# EAGLE design VIC-MIDI_v0.2 (EAGLE 5.11)
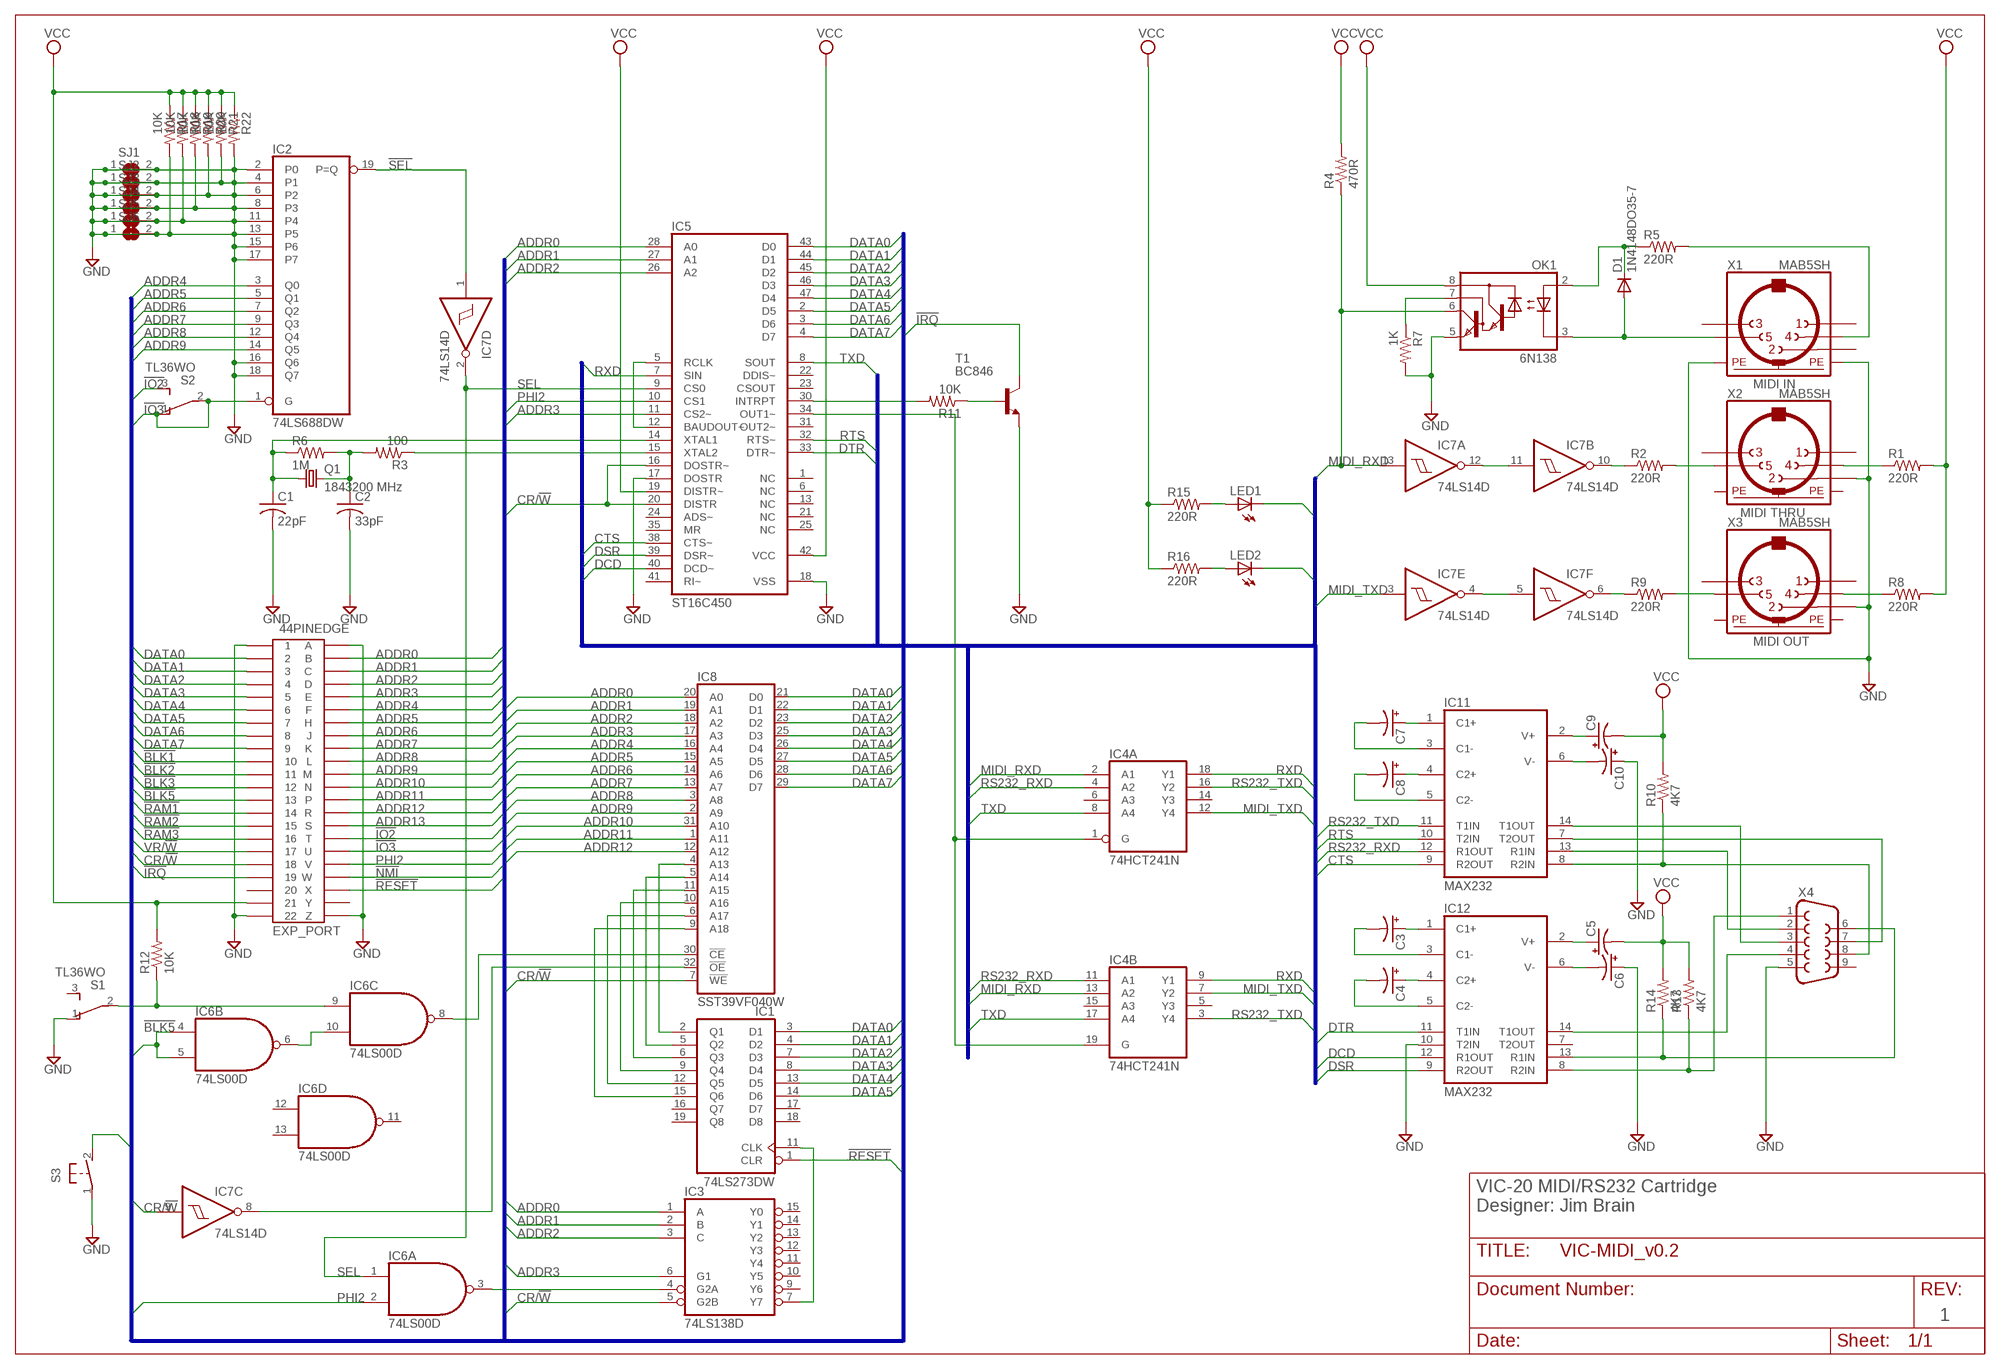
[diagram p0: schematic, sheet 1]

## Parts
44PINEDGE  EXP_PORT  MA-44  [MA-44]
C1  22pF  C-USC0805  [C0805]
C2  33pF  C-USC0805  [C0805]
C3  CPOL-USB  [PANASONIC_B]
C4  CPOL-USB  [PANASONIC_B]
C5  CPOL-USB  [PANASONIC_B]
C6  CPOL-USB  [PANASONIC_B]
C7  CPOL-USB  [PANASONIC_B]
C8  CPOL-USB  [PANASONIC_B]
C9  CPOL-USB  [PANASONIC_B]
C10  CPOL-USB  [PANASONIC_B]
D1  1N4148DO35-7  [DO35-7]
IC1  74LS273DW  [SO20W]
IC2  74LS688DW  [SO20W]
IC3  74LS138D  [SO16]
IC4  74HCT241N  74LS241DW  [SO20W]
IC5  ST16C450  XR-16C450Q  [TQFP48]
IC6  74LS00D  [SO14]
IC7  74LS14D  [SO14]
IC8  SST39VF040W  [TSOP32]
IC11  MAX232  [DIL16]
IC12  MAX232  [DIL16]
LED1  LED3MM  [LED3MM]
LED2  LED3MM  [LED3MM]
OK1  6N138  [DIL08]
Q1  1843200 MHz  CRYSTALHC49UP  [HC49UP]
R1  220R  R-US_R0805  [R0805]
R2  220R  R-US_R0805  [R0805]
R3  100  R-US_R0805  [R0805]
R4  470R  R-US_R0805  [R0805]
R5  220R  R-US_R0805  [R0805]
R6  1M  R-US_R0805  [R0805]
R7  1K  R-US_R0805  [R0805]
R8  220R  R-US_R0805  [R0805]
R9  220R  R-US_R0805  [R0805]
R10  4K7  R-US_M0805  [M0805]
R11  10K  R-US_R0805  [R0805]
R12  10K  R-US_R0805  [R0805]
R13  4K7  R-US_R0805  [R0805]
R14  4K7  R-US_R0805  [R0805]
R15  220R  R-US_R0805  [R0805]
R16  220R  R-US_R0805  [R0805]
R17  10K  R-US_M0805  [M0805]
R18  10K  R-US_M0805  [M0805]
R19  10K  R-US_M0805  [M0805]
R20  10K  R-US_M0805  [M0805]
R21  10K  R-US_M0805  [M0805]
R22  10K  R-US_M0805  [M0805]
S1  TL36WO  [TL3XWO]
S2  TL36WO  [TL3XWO]
S3  31-XX  [B3F-31XX]
SJ1  SJ  [SJ]
SJ2  SJ  [SJ]
SJ3  SJ  [SJ]
SJ4  SJ  [SJ]
SJ5  SJ  [SJ]
SJ6  SJ  [SJ]
T1  BC846  [SOT23]
X1  MAB5SH  [MAB5SH]
X2  MAB5SH  [MAB5SH]
X3  MAB5SH  [MAB5SH]
X4  F09HP  [F09HP]

## Nets
!BLK1: 44PINEDGE.10
!BLK2: 44PINEDGE.11
!BLK3: 44PINEDGE.12
!BLK5: 44PINEDGE.13 IC6.4(B:I0) IC6.5(B:I1)
!IO2: 44PINEDGE.T S2.3(S)
!IO3: 44PINEDGE.U IC2.1(G) S2.1(O) S2.2(P)
!IRQ: 44PINEDGE.19 T1.3(C)
!NMI: 44PINEDGE.W
!RAM1: 44PINEDGE.14
!RAM2: 44PINEDGE.15
!RAM3: 44PINEDGE.16
!RESET: 44PINEDGE.X IC1.1(CLR) S3.2(S)
!SEL: IC2.19(P=Q) IC7.1(D:I)
ADDR0: 44PINEDGE.B IC3.1(A) IC5.28(A0) IC8.20(A0)
ADDR1: 44PINEDGE.C IC3.2(B) IC5.27(A1) IC8.19(A1)
ADDR2: 44PINEDGE.D IC3.3(C) IC5.26(A2) IC8.18(A2)
ADDR3: 44PINEDGE.E IC3.6(G1) IC5.11(CS2~) IC8.17(A3)
ADDR4: 44PINEDGE.F IC2.3(Q0) IC8.16(A4)
ADDR5: 44PINEDGE.H IC2.5(Q1) IC8.15(A5)
ADDR6: 44PINEDGE.J IC2.7(Q2) IC8.14(A6)
ADDR7: 44PINEDGE.K IC2.9(Q3) IC8.13(A7)
ADDR8: 44PINEDGE.L IC2.12(Q4) IC8.3(A8)
ADDR9: 44PINEDGE.M IC2.14(Q5) IC8.2(A9)
ADDR10: 44PINEDGE.N IC8.31(A10)
ADDR11: 44PINEDGE.P IC8.1(A11)
ADDR12: 44PINEDGE.R IC8.12(A12)
ADDR13: 44PINEDGE.S
CR/!W: 44PINEDGE.18 IC3.5(G2B) IC5.16(DOSTR~) IC5.20(DISTR) IC7.9(C:I) IC8.7(!WE)
CTS: IC5.38(CTS~) IC11.9(R2OUT)
DATA0: 44PINEDGE.2 IC1.3(D1) IC5.43(D0) IC8.21(D0)
DATA1: 44PINEDGE.3 IC1.4(D2) IC5.44(D1) IC8.22(D1)
DATA2: 44PINEDGE.4 IC1.7(D3) IC5.45(D2) IC8.23(D2)
DATA3: 44PINEDGE.5 IC1.8(D4) IC5.46(D3) IC8.25(D3)
DATA4: 44PINEDGE.6 IC1.13(D5) IC5.47(D4) IC8.26(D4)
DATA5: 44PINEDGE.7 IC1.14(D6) IC5.2(D5) IC8.27(D5)
DATA6: 44PINEDGE.8 IC5.3(D6) IC8.28(D6)
DATA7: 44PINEDGE.9 IC5.4(D7) IC8.29(D7)
DCD: IC5.40(DCD~) IC12.12(R1OUT)
DSR: IC5.39(DSR~) IC12.9(R2OUT)
DTR: IC5.33(DTR~) IC12.11(T1IN)
GND: 44PINEDGE.1 44PINEDGE.22 44PINEDGE.A 44PINEDGE.Z C1.2 C2.2 C6.+ C10.+ IC2.2(P0) IC2.4(P1) IC2.6(P2) IC2.8(P3) IC2.11(P4) IC2.13(P5) IC2.15(P6) IC2.16(Q6) IC2.17(P7) IC2.18(Q7) IC5.17(DOSTR) IC5.18(VSS) IC12.10(T2IN) OK1.5(GND) R7.2 R17.2 R18.2 R19.2 R20.2 R21.2 R22.2 S1.1(O) S3.1(P) SJ1.1 SJ1.2 SJ2.1 SJ2.2 SJ3.1 SJ3.2 SJ4.1 SJ4.2 SJ5.1 SJ5.2 SJ6.1 SJ6.2 T1.2(E) X1.PE X1.PE@(PE) X2.2 X3.2 X4.5
MIDI_RXD: IC4.2(A:A1) IC4.13(B:A2) IC7.13(A:I) OK1.6(VO) R4.1
MIDI_TXD: IC4.7(B:Y2) IC4.12(A:Y4) IC7.3(E:I)
N$1: R9.2 X3.5
N$2: IC7.6(F:O) R9.1
N$3: R8.1 X3.4
N$4: IC7.4(E:O) IC7.5(F:I)
N$5: LED1.A R15.2
N$6: D1.C OK1.2(A) R5.1
N$7: R5.2 X1.4
N$8: D1.A OK1.3(C) X1.5
N$9: OK1.7(VB) R7.1
N$10: R2.2 X2.5
N$11: IC7.10(B:O) R2.1
N$12: IC7.11(B:I) IC7.12(A:O)
N$13: R1.1 X2.4
N$14: IC1.11(CLK) IC3.7(Y7)
N$15: IC5.15(XTAL2) R3.1
N$16: C1.1 IC5.14(XTAL1) Q1.1 R6.1
N$17: C2.1 Q1.2 R3.2 R6.2
N$18: IC1.5(Q2) IC8.5(A14)
N$19: IC5.5(RCLK) IC5.12(BAUDOUT~)
N$20: IC1.2(Q1) IC8.4(A13)
N$21: IC1.6(Q3) IC8.11(A15)
N$22: IC1.9(Q4) IC8.10(A16)
N$23: IC6.6(B:O) IC6.10(C:I1)
N$24: IC7.8(C:O) IC8.32(!OE)
N$25: LED2.A R16.2
N$26: IC6.8(C:O) IC8.30(!CE)
N$27: IC6.9(C:I0) R12.1 S1.2(P)
N$28: IC1.12(Q5) IC8.6(A17)
N$29: IC3.4(G2A) IC6.3(A:O)
N$30: IC1.15(Q6) IC8.9(A18)
N$31: IC5.30(INTRPT) R11.2
N$32: R11.1 T1.1(B)
N$35: IC4.1(A:G) IC4.19(B:G) IC5.34(OUT1~)
N$36: C3.+ IC12.1(C1+)
N$37: C3.- IC12.3(C1-)
N$38: C4.+ IC12.4(C2+)
N$39: C4.- IC12.5(C2-)
N$40: C5.+ IC12.2(V+)
N$41: C6.- IC12.6(V-)
N$42: C7.+ IC11.1(C1+)
N$43: C7.- IC11.3(C1-)
N$44: C8.+ IC11.4(C2+)
N$45: C8.- IC11.5(C2-)
N$46: C9.+ IC11.2(V+)
N$47: C10.- IC11.6(V-)
N$50: IC12.14(T1OUT) X4.4
N$51: IC11.14(T1OUT) X4.3
N$52: IC11.7(T2OUT) X4.7
N$53: IC11.8(R2IN) R10.1 X4.8
N$55: IC12.13(R1IN) R14.1 X4.6
N$56: IC12.8(R2IN) R13.1 X4.1
N$58: IC11.13(R1IN) X4.2
PHI2: 44PINEDGE.V IC5.10(CS1) IC6.2(A:I1)
RS232_RXD: IC4.4(A:A2) IC4.11(B:A1) IC11.12(R1OUT)
RS232_TXD: IC4.3(B:Y4) IC4.16(A:Y2) IC11.11(T1IN)
RTS: IC5.32(RTS~) IC11.10(T2IN)
RXD: IC4.9(B:Y1) IC4.18(A:Y1) IC5.7(SIN) LED2.K(C)
SEL: IC5.9(CS0) IC6.1(A:I0) IC7.2(D:O)
TXD: IC4.8(A:A4) IC4.17(B:A4) IC5.8(SOUT) LED1.K(C)
VCC: 44PINEDGE.21 C5.- C9.- IC5.19(DISTR~) IC5.42(VCC) OK1.8(VCC) R1.2 R4.2 R8.2 R10.2 R12.2 R13.2 R14.2 R15.1 R16.1 R17.1 R18.1 R19.1 R20.1 R21.1 R22.1
VR/!W: 44PINEDGE.17
Unconnected: 44PINEDGE.20 44PINEDGE.Y IC1.16(Q7) IC1.17(D7) IC1.18(D8) IC1.19(Q8) IC3.9(Y6) IC3.10(Y5) IC3.11(Y4) IC3.12(Y3) IC3.13(Y2) IC3.14(Y1) IC3.15(Y0) IC4.5(B:Y3) IC4.6(A:A3) IC4.14(A:Y3) IC4.15(B:A3) IC5.1(NC) IC5.6(NC) IC5.13(NC) IC5.21(NC) IC5.22(DDIS~) IC5.23(CSOUT) IC5.24(ADS~) IC5.25(NC) IC5.31(OUT2~) IC5.35(MR) IC5.41(RI~) IC6.11(D:O) IC6.12(D:I0) IC6.13(D:I1) IC12.7(T2OUT) S1.3(S) X1.1 X1.2 X1.3 X2.1 X2.3 X3.1 X3.3 X4.9

## Buses
DATA[0..7],ADDR[0..13],VR/!W,CR/!W,!BLK1,!BLK2,!BLK3,!BLK5,!RAM1,!RAM2,!RAM3,!IRQ,!NMI,!IO2,!IO3,PHI2,!RESET
RXD,TXD,DCD,RTS,CTS,DSR,DTR,MIDI_RXD,MIDI_TXD,RS232_RXD,RS232_TXD

## Notes on the sheet
- MIDI IN
- MIDI THRU
- MIDI OUT
- VIC-20 MIDI/RS232 Cartridge
- Designer: Jim Brain
- 1

## Power pins joined to a net without a drawn wire
GND: IC1.10(GND) IC2.10(GND) IC3.8(GND) IC4.10(P:GND) IC6.7(P:GND) IC7.7(P:GND) IC8.24(GND) IC11.15(GND) IC12.15(GND)
PE: X2.PE X2.PE@(PE) X3.PE X3.PE@(PE)
VCC: IC1.20(VCC) IC2.20(VCC) IC3.16(VCC) IC4.20(P:VCC) IC6.14(P:VCC) IC7.14(P:VCC) IC8.8(VCC) IC11.16(VCC) IC12.16(VCC)

## Library data of the parts
44PINEDGE = con-edge-156:MA-44: 44 PIN EDGE CONNECTOR FOR PCB
C1 C2 = rcl:C-US: CAPACITOR, American symbol
C3-C10 = rcl:CPOL-US: POLARIZED CAPACITOR, American symbol
D1 = diode:1N4148: DIODE high speed (Philips)
IC1 = 74xx-us:74*273: Octal D type FLIP FLOP, clear
IC2 = 74xx-us:74*688: 8-bit MAGNITUDE/IDENTITY COMPARATOR, totem pole
IC3 = 74xx-us:74*138: 3-line to 8-line DECODER/DEMULTIPLEXER
IC4 = 74xx-us:74*241: Octal BUFFER and LINE DRIVER, 3-state
IC5 = exar:XR-16C450Q: UART
IC6 = 74xx-us:74*00: Quad 2-input NAND gate
IC7 = 74xx-us:74*14: Hex schmitt trigger INVERTER
IC8 = memory:SST39VF040: 4 Mbit x8 Multi-Purpose Flash Source: http://www.sst.com/dotAsset/40782.pdf
IC11 IC12 = maxim:MAX232: RS232 TRANSEIVER
LED1 LED2 = led:LED: LED OSRAM: - CHIPLED LG R971, LG N971, LY N971, LG Q971, LY Q971, LO R971, LY R971 LH N974, LH R974 LS Q976, LO Q976, LY Q976 LO Q996 - Hyper CHIPLED LW Q18S LB Q993, LB Q99A, LB R99A - SideLED LS A670, LO A670, LY A670, LG A670, LP A670 LB A673, LV A673, LT A673, LW A673 LH A674 LY A675 LS A676, LA A676, LO A676, LY A676, LW A676 LS A679, LY A679, LG A679 - Hyper Micro SIDELED® LS Y876, LA Y876, LO Y876, LY Y876 LT Y87S - SmartLED LW L88C, LW L88S LB L89C, LB L89S, LG L890 LS L89K, LO L89K, LY L89K LS L896, LA L896, LO L896, LY L896 - TOPLED LS T670, LO T670, LY T670, LG T670, LP T670 LSG T670, LSP T670, LSY T670, LOP T670, LYG T670 LG T671, LOG T671, LSG T671 LB T673, LV T673, LT T673, LW T673 LH T674 LS T676, LA T676, LO T676, LY T676, LB T676, LH T676, LSB T676, LW T676 LB T67C, LV T67C, LT T67C, LS T67K, LO T67K, LY T67K, LW E67C LS E67B, LA E67B, LO E67B, LY E67B, LB E67C, LV E67C, LT E67C LW T67C LS T679, LY T679, LG T679 LS T770, LO T770, LY T770, LG T770, LP T770 LB T773, LV T773, LT T773, LW T773 LH T774 LS E675, LA E675, LY E675, LS T675 LS T776, LA T776, LO T776, LY T776, LB T776 LHGB T686 LT T68C, LB T68C - Hyper Mini TOPLED® LB M676 - Mini TOPLED Santana® LG M470 LS M47K, LO M47K, LY M47K Source: http://www.osram.convergy.de LUXEON: - LUMILED® LXK2-PW12-R00, LXK2-PW12-S00, LXK2-PW14-U00, LXK2-PW14-V00 LXK2-PM12-R00, LXK2-PM12-S00, LXK2-PM14-U00 LXK2-PE12-Q00, LXK2-PE12-R00, LXK2-PE12-S00, LXK2-PE14-T00, LXK2-PE14-U00 LXK2-PB12-K00, LXK2-PB12-L00, LXK2-PB12-M00, LXK2-PB14-N00, LXK2-PB14-P00, LXK2-PB14-Q00 LXK2-PR12-L00, LXK2-PR12-M00, LXK2-PR14-Q00, LXK2-PR14-R00 LXK2-PD12-Q00, LXK2-PD12-R00, LXK2-PD12-S00 LXK2-PH12-R00, LXK2-PH12-S00 LXK2-PL12-P00, LXK2-PL12-Q00, LXK2-PL12-R00 Source: www.luxeon.com KINGBRIGHT: KA-3528ASYC Source: www.kingbright.com
OK1 = optocoupler:6N138: MOTOROLA OPTO COUPLER; MF: VISHAY/TELEFUNKEN; MPN: 6N138; OC_FARNELL: 9860150; OC_NEWARK: 35K5294
Q1 = crystal:CRYSTAL: CRYSTAL
R1-R9 R11 R12 R15-R22 = resistor:R-US_: RESISTOR, American symbol
R10 R13 R14 = rcl:R-US_: RESISTOR, American symbol
S1 S2 = switch:TL36WO: TINY SWITCH ON - ON Source: http://www2.produktinfo.conrad.com/datenblaetter/700000-724999/705152-da-01-de-Subminiaturschalter_TL_36WO.pdf
S3 = switch-omron:31-XX: OMRON SWITCH; MPN: B3F-3100; OC_FARNELL: 959704; OC_NEWARK: 36M3582
SJ1-SJ6 = jumper:SJ: SMD solder JUMPER
T1 = transistor:BC846: NPN TRANSISTOR
X1-X3 = con-hirschmann:MAB5SH: Female CONNECTOR 5 pins 90 deg. with shield, horizontal (DIN 41524)
X4 = con-subd:F09: SUB-D; OC_FARNELL: unknown; OC_NEWARK: unknown

## Board
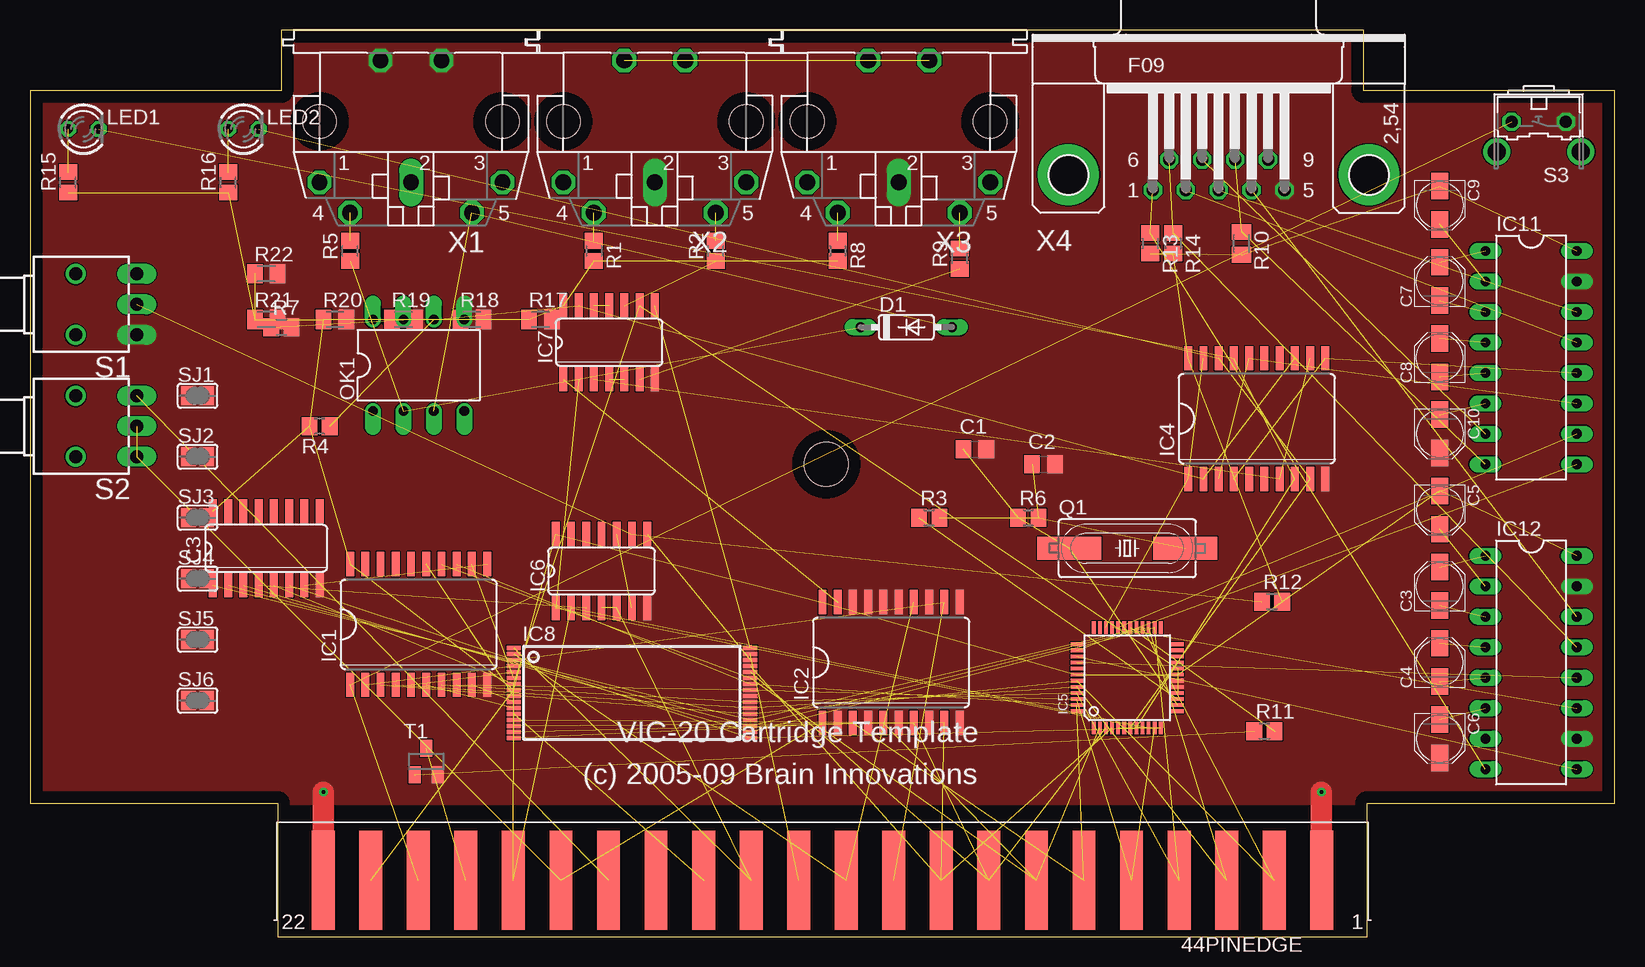
[diagram p1: board, top side]
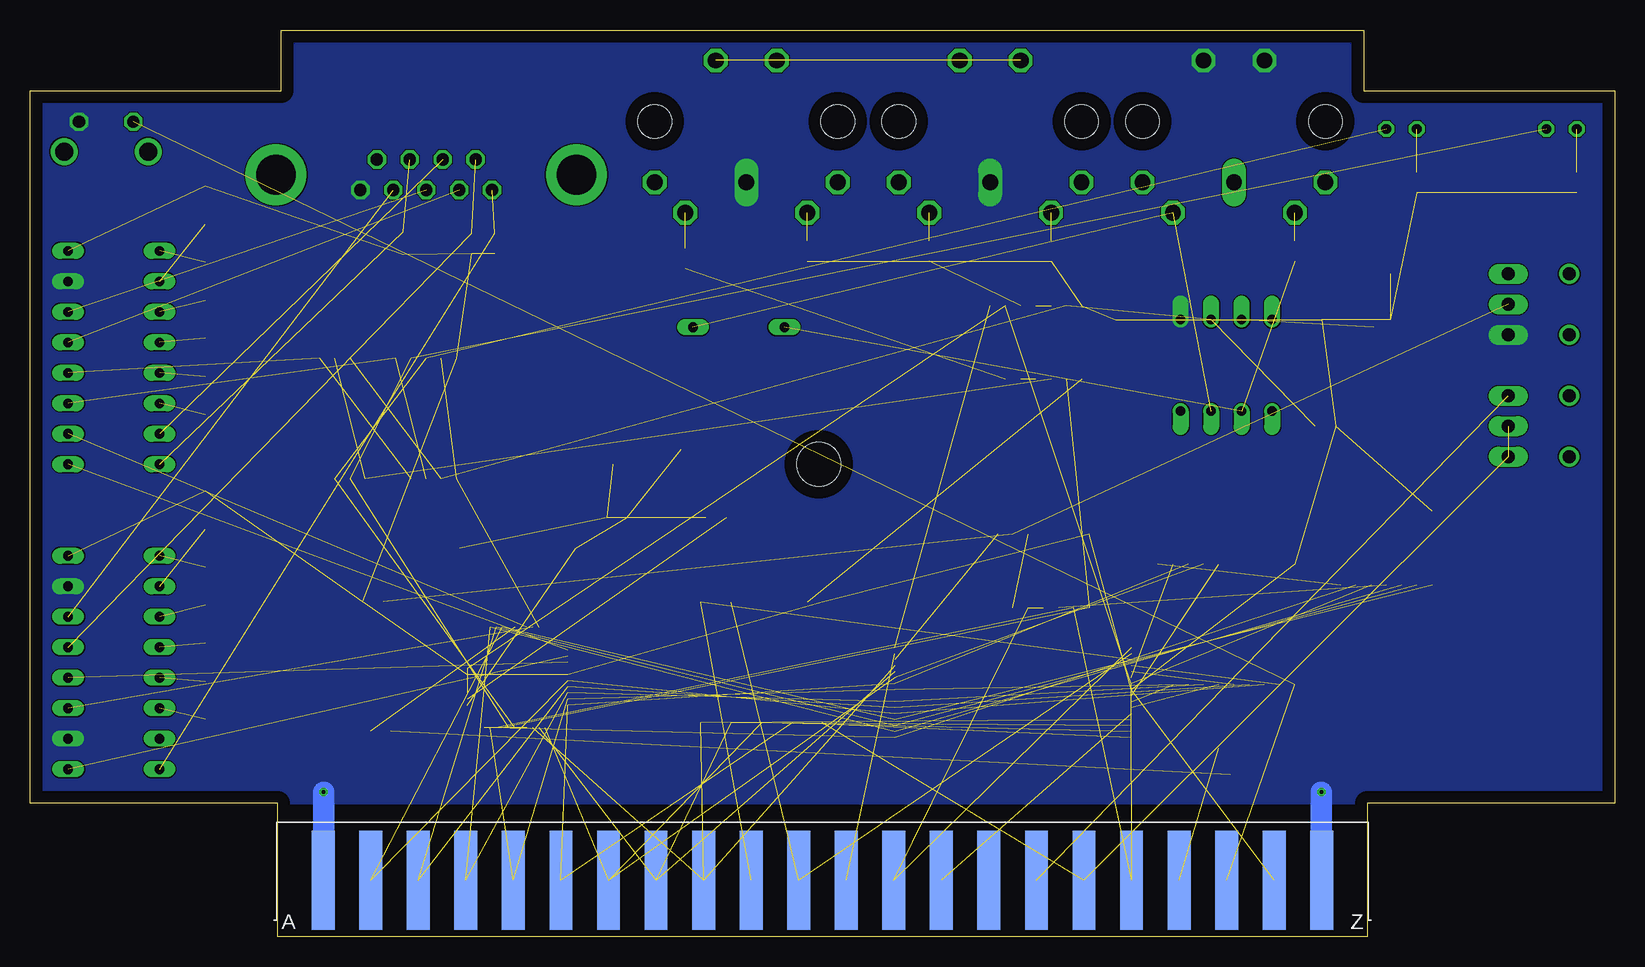
[diagram p2: board, bottom side, seen from below]

Size 132.08 x 75.56 mm. Coordinates in mm from the lower left corner, seen from the top.
Outline: 20.64,0 111.44,0 111.44,11.11 132.08,11.11 132.08,70.48 111.12,70.48 111.12,75.56 20.95,75.56 20.95,70.48 0,70.48 0,11.11 20.64,11.11 20.64,0
Copper layers (1*16): Top 0.035mm / dielectric 1.5mm / Bottom 0.035mm
Design rules "ourpcb-small": minimum track width 4mil, minimum drill 12mil, track to track 4mil, track to pad 4mil, pad to pad 4mil, via to via 4mil, smd to smd 0mil, copper to edge 40mil, drill to drill 8mil, minimum pad ring 10mil, minimum via ring 8mil, stop-mask expansion 4mil, vias tented up to drill 0mil, thermal gap 10mil
Holes 3.64 mm at 66.36,39.37

### Footprints (pad centres in the part's own frame; a part is rotated, then mirrored left to right if it is on the bottom)
MA-44 = smd 1.905 x 8.255: 1 -41.605,4.826; 2 -37.643,4.826; 3 -33.68,4.826; 4 -29.718,4.826; 5 -25.756,4.826; 6 -21.793,4.826; 7 -17.831,4.826; 8 -13.868,4.826; 9 -9.906,4.826; 10 -5.944,4.826; 11 -1.981,4.826; 12 1.981,4.826; 13 5.944,4.826; 14 9.906,4.826; 15 13.868,4.826; 16 17.831,4.826; 17 21.793,4.826; 18 25.756,4.826; 19 29.718,4.826; 20 33.68,4.826; 21 37.643,4.826; 22 41.605,4.826 | smd 1.905 x 8.255 bottom: A -41.605,4.826; B -37.643,4.826; C -33.68,4.826; D -29.718,4.826; E -25.756,4.826; F -21.793,4.826; H -17.831,4.826; J -13.868,4.826; K -9.906,4.826; L -5.944,4.826; M -1.981,4.826; N 1.981,4.826; P 5.944,4.826; R 9.906,4.826; S 13.868,4.826; T 17.831,4.826; U 21.793,4.826; V 25.756,4.826; W 29.718,4.826; X 33.68,4.826; Y 37.643,4.826; Z 41.605,4.826
C0805 = smd 1.3 x 1.5: 1 -0.95,0; 2 0.95,0
PANASONIC_B = smd 2.2 x 1.4: + 1.6,0; - -1.6,0
DO35-7 = drill 0.813 long: A 3.81,0; C -3.81,0
SO20W = smd 0.66 x 2.032: 1 -5.715,-5.029; 2 -4.445,-5.029; 3 -3.175,-5.029; 4 -1.905,-5.029; 5 -0.635,-5.029; 6 0.635,-5.029; 7 1.905,-5.029; 8 3.175,-5.029; 9 4.445,-5.029; 10 5.715,-5.029; 11 5.715,5.029; 12 4.445,5.029; 13 3.175,5.029; 14 1.905,5.029; 15 0.635,5.029; 16 -0.635,5.029; 17 -1.905,5.029; 18 -3.175,5.029; 19 -4.445,5.029; 20 -5.715,5.029
SO16 = smd 0.66 x 2.032: 1 -4.445,-3.073; 2 -3.175,-3.073; 3 -1.905,-3.073; 4 -0.635,-3.073; 5 0.635,-3.073; 6 1.905,-3.073; 7 3.175,-3.073; 8 4.445,-3.073; 9 4.445,3.073; 10 3.175,3.073; 11 1.905,3.073; 12 0.635,3.073; 13 -0.635,3.073; 14 -1.905,3.073; 15 -3.175,3.073; 16 -4.445,3.073
TQFP48 = smd 1.016 x 0.305: 1 -4.191,2.794; 2 -4.191,2.286; 3 -4.191,1.778; 4 -4.191,1.27; 5 -4.191,0.762; 6 -4.191,0.254; 7 -4.191,-0.254; 8 -4.191,-0.762; 9 -4.191,-1.27; 10 -4.191,-1.778; 11 -4.191,-2.286; 12 -4.191,-2.794; 25 4.191,-2.794; 26 4.191,-2.286; 27 4.191,-1.778; 28 4.191,-1.27; 29 4.191,-0.762; 30 4.191,-0.254; 31 4.191,0.254; 32 4.191,0.762; 33 4.191,1.27; 34 4.191,1.778; 35 4.191,2.286; 36 4.191,2.794 | smd 0.305 x 1.016: 13 -2.794,-4.191; 14 -2.286,-4.191; 15 -1.778,-4.191; 16 -1.27,-4.191; 17 -0.762,-4.191; 18 -0.254,-4.191; 19 0.254,-4.191; 20 0.762,-4.191; 21 1.27,-4.191; 22 1.778,-4.191; 23 2.286,-4.191; 24 2.794,-4.191; 37 2.794,4.191; 38 2.286,4.191; 39 1.778,4.191; 40 1.27,4.191; 41 0.762,4.191; 42 0.254,4.191; 43 -0.254,4.191; 44 -0.762,4.191; 45 -1.27,4.191; 46 -1.778,4.191; 47 -2.286,4.191; 48 -2.794,4.191
SO14 = smd 0.66 x 2.032: 1 -3.81,-3.073; 2 -2.54,-3.073; 3 -1.27,-3.073; 4 0,-3.073; 5 1.27,-3.073; 6 2.54,-3.073; 7 3.81,-3.073; 8 3.81,3.073; 9 2.54,3.073; 10 1.27,3.073; 11 0,3.073; 12 -1.27,3.073; 13 -2.54,3.073; 14 -3.81,3.073
TSOP32 = smd 1.2 x 0.36: 1 -9.85,3.75; 2 -9.85,3.25; 3 -9.85,2.75; 4 -9.85,2.25; 5 -9.85,1.75; 6 -9.85,1.25; 7 -9.85,0.75; 8 -9.85,0.25; 9 -9.85,-0.25; 10 -9.85,-0.75; 11 -9.85,-1.25; 12 -9.85,-1.75; 13 -9.85,-2.25; 14 -9.85,-2.75; 15 -9.85,-3.25; 16 -9.85,-3.75; 17 9.85,-3.75; 18 9.85,-3.25; 19 9.85,-2.75; 20 9.85,-2.25; 21 9.85,-1.75; 22 9.85,-1.25; 23 9.85,-0.75; 24 9.85,-0.25; 25 9.85,0.25; 26 9.85,0.75; 27 9.85,1.25; 28 9.85,1.75; 29 9.85,2.25; 30 9.85,2.75; 31 9.85,3.25; 32 9.85,3.75
DIL16 = drill 0.813 long: 1 -8.89,-3.81; 2 -6.35,-3.81; 3 -3.81,-3.81; 4 -1.27,-3.81; 5 1.27,-3.81; 6 3.81,-3.81; 7 6.35,-3.81; 8 8.89,-3.81; 9 8.89,3.81; 10 6.35,3.81; 11 3.81,3.81; 12 1.27,3.81; 13 -1.27,3.81; 14 -3.81,3.81; 15 -6.35,3.81; 16 -8.89,3.81
LED3MM = drill 0.813 octagon: A -1.27,0; K 1.27,0
DIL08 = drill 0.813 offset: 1 -3.81,-3.81; 2 -1.27,-3.81; 3 1.27,-3.81; 4 3.81,-3.81; 5 3.81,3.81; 6 1.27,3.81; 7 -1.27,3.81; 8 -3.81,3.81
HC49UP = smd 5.334 x 1.93: 1 -4.826,0; 2 4.826,0
R0805 = smd 1.3 x 1.5: 1 -0.85,0; 2 0.85,0
M0805 = smd 1.3 x 1.6: 1 -0.95,0; 2 0.95,0
TL3XWO = drill 1.1 pad 1.422 long: 1 -2.54,-5.08; 2 0,-5.08; 3 2.54,-5.08 | drill 1.1 pad 1.676 round: M1 -2.54,0; M2 2.54,0
B3F-31XX = drill 1.016 octagon: 1 -2.261,-1.245; 2 2.261,-1.245 | drill 1.499 pad 2.159 round: 3 -3.505,1.245; 4 3.505,1.245
SJ = smd 1.168 x 1.6: 1 -0.762,0; 2 0.762,0
SOT23 = smd 1 x 1.4: 1 -0.95,-1.1; 2 0.95,-1.1; 3 0,1.1
MAB5SH = drill 1.321 octagon: 1 7.62,5.08; 3 -7.62,5.08; 4 5.08,7.62; 5 -5.08,7.62; PE -2.54,-5.08; PE@ 2.54,-5.08 | drill 1.321 long: 2 0,5.08 | hole 2.794: 7.62,0; -7.62,0
F09HP = drill 1.016 octagon: 1 -5.486,-1.27; 2 -2.743,-1.27; 3 0,-1.27; 4 2.743,-1.27; 5 5.486,-1.27; 6 -4.115,1.27; 7 -1.372,1.27; 8 1.372,1.27; 9 4.115,1.27 | drill 3.302 pad 5.08 round: G1 -12.522,0; G2 12.522,0

### Placement (x,y rotation side)
44PINEDGE  66.04,9.53 180 top
C1  78.74,40.64 0 top
C2  84.45,39.37 0 top
C3  117.47,29.21 90 top
C4  117.47,22.86 90 top
C5  117.47,35.56 270 top
C6  117.47,16.51 270 top
C7  117.47,54.61 90 top
C8  117.47,48.26 90 top
C9  117.47,60.96 270 top
C10  117.47,41.91 270 top
D1  73.02,50.8 0 top
IC1  32.38,26.04 0 top
IC2  71.75,22.86 0 top
IC3  19.69,32.38 0 top
IC4  102.23,43.18 0 top
IC5  91.44,21.59 90 top
IC6  47.62,30.48 0 top
IC7  48.26,49.53 0 top
IC8  50.16,20.32 0 top
IC11  125.09,48.26 270 top
IC12  125.09,22.86 270 top
LED1  4.44,67.31 0 top
LED2  17.78,67.31 0 top
OK1  32.38,47.62 0 top
Q1  91.44,32.38 0 top
R1  46.99,57.15 270 top
R2  57.15,57.15 90 top
R3  74.93,34.92 0 top
R4  24.13,42.55 180 top
R5  26.67,57.15 90 top
R6  83.18,34.92 0 top
R7  20.95,50.8 0 top
R8  67.31,57.15 270 top
R9  77.47,56.52 90 top
R10  100.96,57.78 270 top
R11  102.87,17.14 0 top
R12  103.5,27.94 0 top
R13  93.34,57.78 270 top
R14  95.25,57.78 270 top
R15  3.17,62.87 90 top
R16  16.51,62.87 90 top
R17  42.55,51.44 0 top
R18  36.83,51.44 0 top
R19  31.12,51.44 0 top
R20  25.4,51.44 0 top
R21  19.69,51.44 0 top
R22  19.69,55.24 0 top
S1  3.81,52.7 90 top
S2  3.81,42.55 90 top
S3  125.73,66.67 180 top
SJ1  13.97,45.09 0 top
SJ2  13.97,40.01 0 top
SJ3  13.97,34.92 0 top
SJ4  13.97,29.84 0 top
SJ5  13.97,24.77 0 top
SJ6  13.97,19.68 0 top
T1  33.02,14.61 0 top
X1  31.75,67.94 180 top
X2  52.07,67.94 180 top
X3  72.39,67.94 180 top
X4  99.06,63.5 0 top

### Tracks (layer width: path | path; a pad name or v marks a point on that pad's centre or on a via)
!BLK5  (2 unrouted)
!IO2  (1 unrouted)
!IO3  (3 unrouted)
!IRQ  (1 unrouted)
!RESET  (2 unrouted)
!SEL  (1 unrouted)
ADDR0  (3 unrouted)
ADDR1  (3 unrouted)
ADDR2  (3 unrouted)
ADDR3  (3 unrouted)
ADDR4  (2 unrouted)
ADDR5  (2 unrouted)
ADDR6  (2 unrouted)
ADDR7  (2 unrouted)
ADDR8  (2 unrouted)
ADDR9  (2 unrouted)
ADDR10  (1 unrouted)
ADDR11  (1 unrouted)
ADDR12  (1 unrouted)
CR/!W  (5 unrouted)
CTS  (1 unrouted)
DATA0  (3 unrouted)
DATA1  (3 unrouted)
DATA2  (3 unrouted)
DATA3  (3 unrouted)
DATA4  (3 unrouted)
DATA5  (3 unrouted)
DATA6  (2 unrouted)
DATA7  (2 unrouted)
DCD  (1 unrouted)
DSR  (1 unrouted)
DTR  (1 unrouted)
GND  (via drill 0.3)
  Top 1.778: 44PINEDGE.A v107.62,12.06 | 44PINEDGE.22 24.45,4.7 v24.45,12.06
  Bottom 1.778: 44PINEDGE.A v107.62,12.06 | 44PINEDGE.22 v24.46,12.06
  pour Top (no thermals): 20.95,75.56 20.95,70.48 0,70.48 0,11.11 132.08,11.11 132.08,70.48 111.12,70.48 111.12,75.56
  pour Bottom (no thermals): 0,11.11 132.08,11.11 132.08,70.48 111.12,70.48 111.12,75.56 20.95,75.56 20.95,70.48 0,70.48
MIDI_RXD  (4 unrouted)
MIDI_TXD  (2 unrouted)
N$1  (1 unrouted)
N$2  (1 unrouted)
N$3  (1 unrouted)
N$4  (1 unrouted)
N$5  (1 unrouted)
N$6  (2 unrouted)
N$7  (1 unrouted)
N$8  (2 unrouted)
N$9  (1 unrouted)
N$10  (1 unrouted)
N$11  (1 unrouted)
N$12  (1 unrouted)
N$13  (1 unrouted)
N$14  (1 unrouted)
N$15  (1 unrouted)
N$16  (3 unrouted)
N$17  (3 unrouted)
N$18  (1 unrouted)
N$19  (1 unrouted)
N$20  (1 unrouted)
N$21  (1 unrouted)
N$22  (1 unrouted)
N$23  (1 unrouted)
N$24  (1 unrouted)
N$25  (1 unrouted)
N$26  (1 unrouted)
N$27  (2 unrouted)
N$28  (1 unrouted)
N$29  (1 unrouted)
N$30  (1 unrouted)
N$31  (1 unrouted)
N$32  (1 unrouted)
N$35  (2 unrouted)
N$36  (1 unrouted)
N$37  (1 unrouted)
N$38  (1 unrouted)
N$39  (1 unrouted)
N$40  (1 unrouted)
N$41  (1 unrouted)
N$42  (1 unrouted)
N$43  (1 unrouted)
N$44  (1 unrouted)
N$45  (1 unrouted)
N$46  (1 unrouted)
N$47  (1 unrouted)
N$50  (1 unrouted)
N$51  (1 unrouted)
N$52  (1 unrouted)
N$53  (2 unrouted)
N$55  (2 unrouted)
N$56  (2 unrouted)
N$58  (1 unrouted)
PE  (3 unrouted)
PHI2  (2 unrouted)
RS232_RXD  (2 unrouted)
RS232_TXD  (2 unrouted)
RTS  (1 unrouted)
RXD  (3 unrouted)
SEL  (2 unrouted)
TXD  (3 unrouted)
VCC  (29 unrouted)

### Text on the board
tPlace: VIC-20 Cartridge Template | (c) 2005-09 Brain Innovations